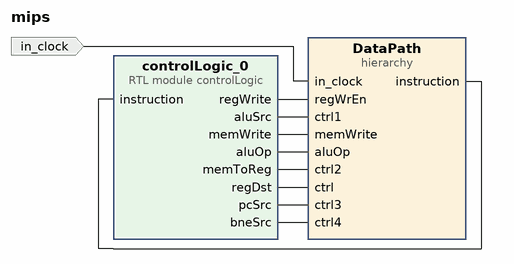
[diagram p0: block diagram of the top level]
# Vivado block design mips, xc7z020clg400-1, Vivado 2020.2
create_bd_design mips

create_bd_port -dir I -type clk in_clock

create_bd_cell -type hier DataPath
create_bd_cell -type module -reference controlLogic controlLogic_0

# ---- hierarchy /DataPath ----
current_bd_instance /DataPath
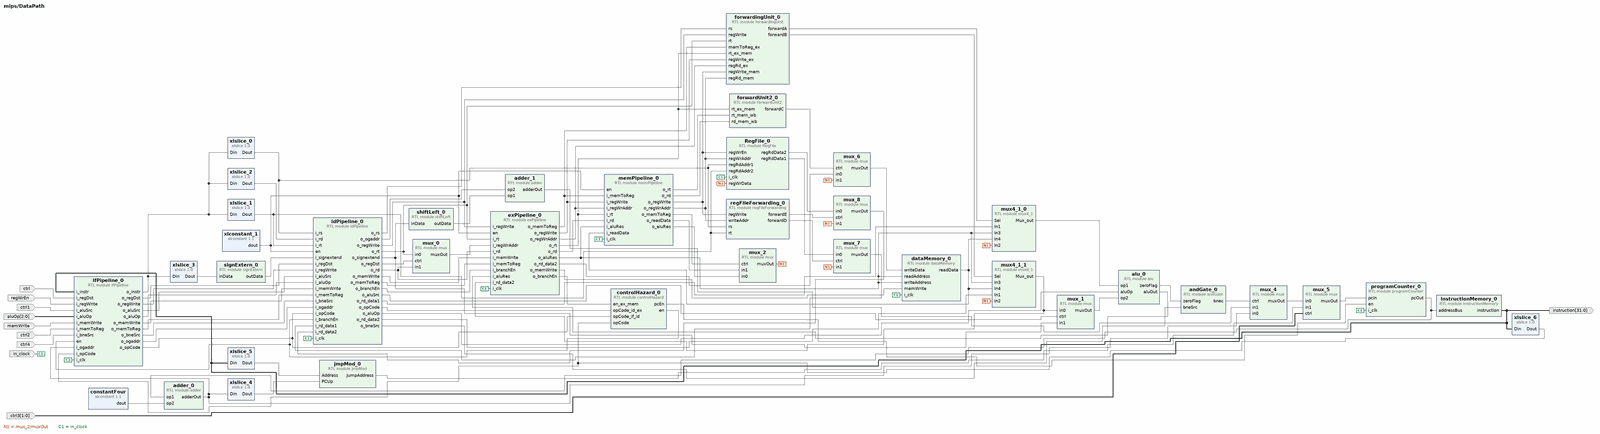
[diagram p1: block diagram inside /DataPath, whole]
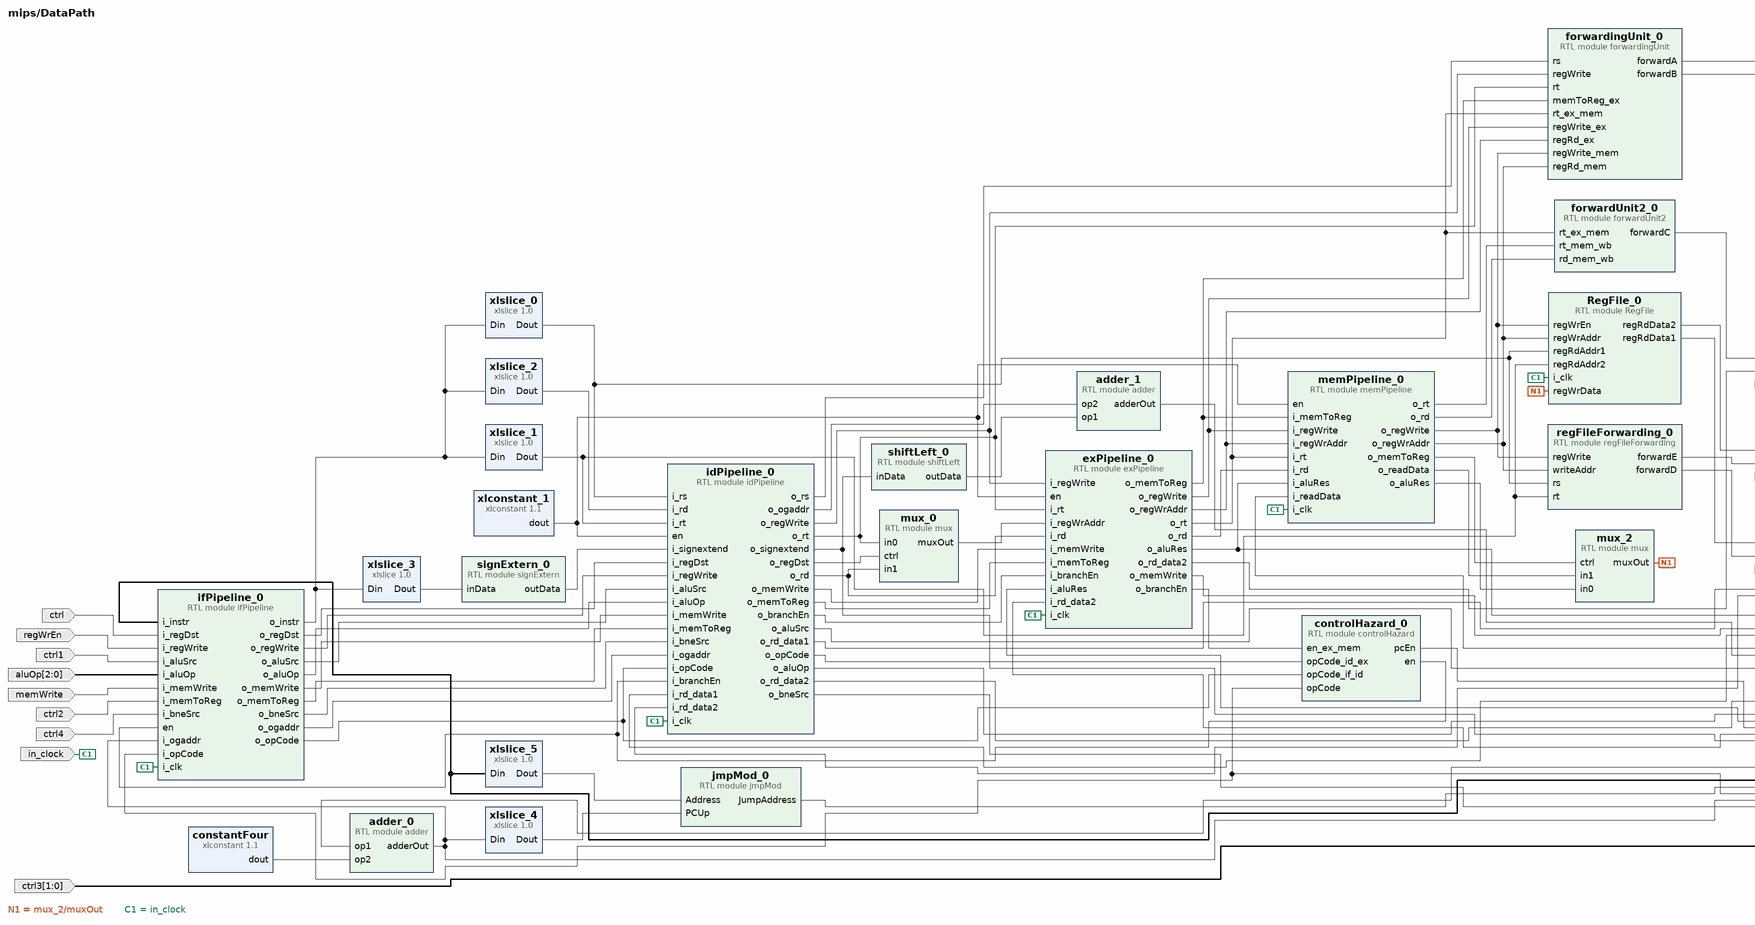
[diagram p2: block diagram inside /DataPath, left part]
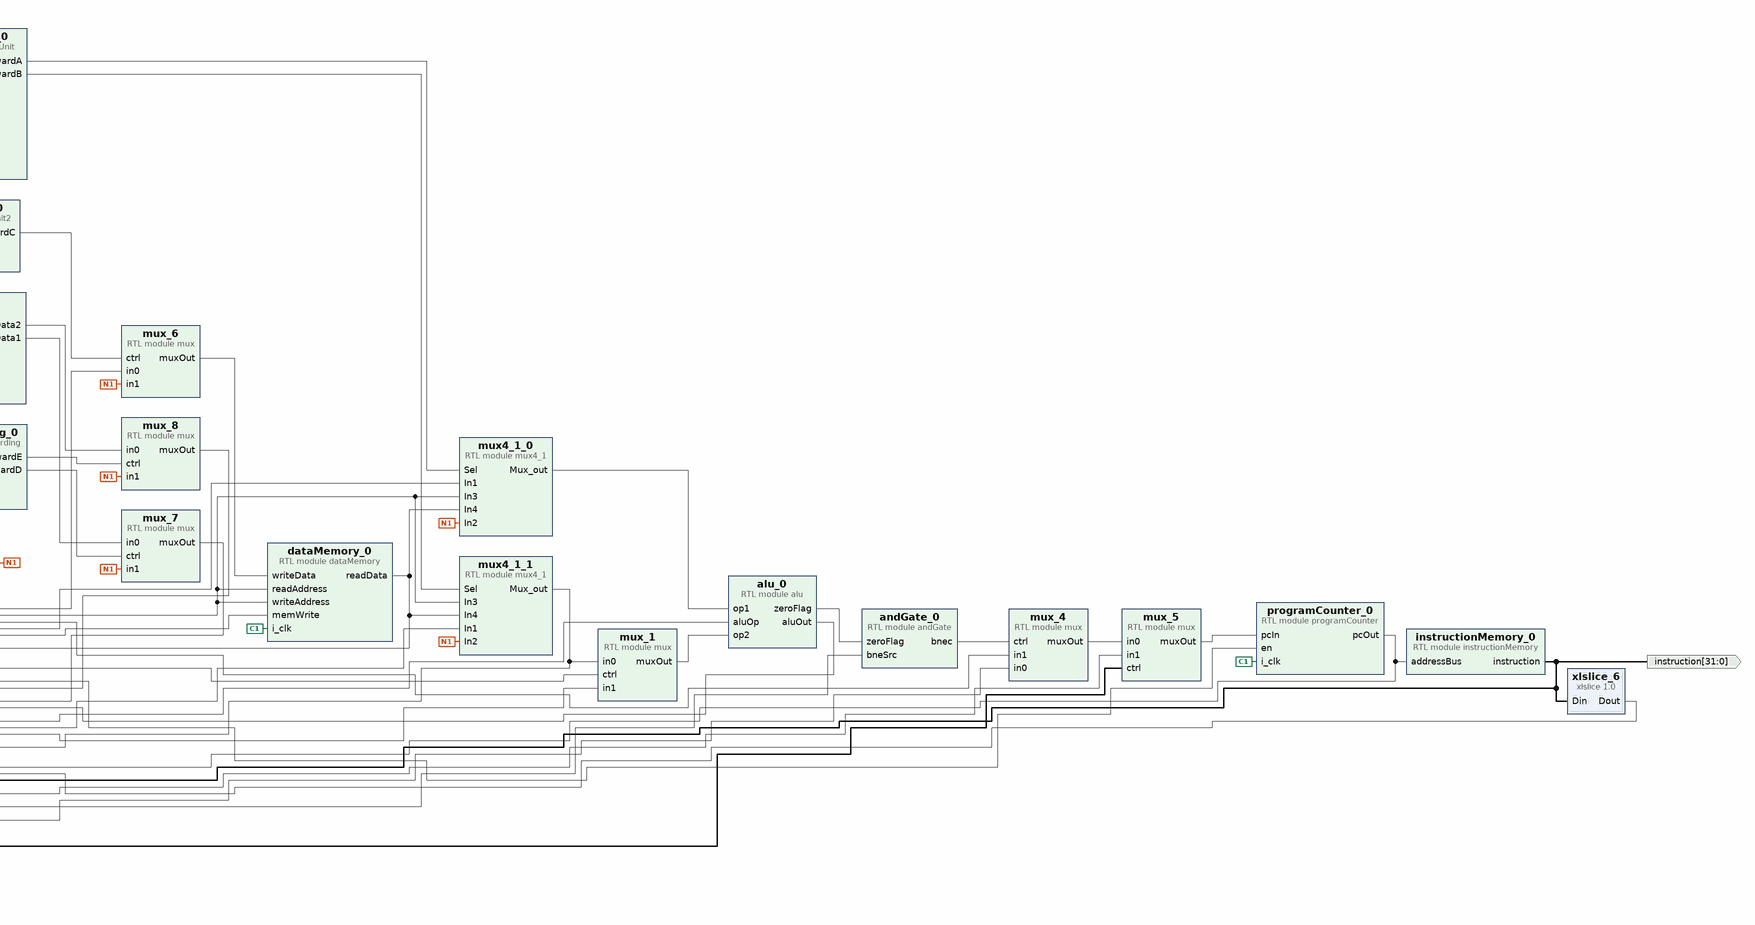
[diagram p3: block diagram inside /DataPath, right part]
create_bd_pin -dir I -from 2 -to 0 aluOp
create_bd_pin -dir I ctrl
create_bd_pin -dir O -from 31 -to 0 instruction
create_bd_pin -dir I ctrl1
create_bd_pin -dir I -type clk in_clock
create_bd_pin -dir I ctrl2
create_bd_pin -dir I -from 1 -to 0 ctrl3
create_bd_pin -dir I memWrite
create_bd_pin -dir I regWrEn
create_bd_pin -dir I ctrl4

create_bd_cell -type module -reference alu alu_0
create_bd_cell -type module -reference mux mux_0
set_property -dict {CONFIG.width 5} [get_bd_cells mux_0]
create_bd_cell -type ip -vlnv xilinx.com:ip:xlslice:1.0 xlslice_0
set_property -dict {CONFIG.DIN_FROM 25 CONFIG.DIN_TO 21 CONFIG.DOUT_WIDTH 5} [get_bd_cells xlslice_0]
create_bd_cell -type module -reference mux mux_1
set_property -dict {CONFIG.width 32} [get_bd_cells mux_1]
create_bd_cell -type module -reference mux mux_2
set_property -dict {CONFIG.width 32} [get_bd_cells mux_2]
create_bd_cell -type module -reference shiftLeft shiftLeft_0
create_bd_cell -type ip -vlnv xilinx.com:ip:xlslice:1.0 xlslice_1
set_property -dict {CONFIG.DIN_FROM 20 CONFIG.DIN_TO 16 CONFIG.DOUT_WIDTH 5} [get_bd_cells xlslice_1]
create_bd_cell -type ip -vlnv xilinx.com:ip:xlslice:1.0 xlslice_2
set_property -dict {CONFIG.DIN_FROM 15 CONFIG.DIN_TO 11 CONFIG.DOUT_WIDTH 5} [get_bd_cells xlslice_2]
create_bd_cell -type ip -vlnv xilinx.com:ip:xlconstant:1.1 constantFour
set_property -dict {CONFIG.CONST_VAL 4 CONFIG.CONST_WIDTH 32} [get_bd_cells constantFour]
create_bd_cell -type module -reference signExtern signExtern_0
create_bd_cell -type module -reference adder adder_0
set_property -dict {CONFIG.width 32} [get_bd_cells adder_0]
create_bd_cell -type module -reference adder adder_1
set_property -dict {CONFIG.width 32} [get_bd_cells adder_1]
create_bd_cell -type module -reference dataMemory dataMemory_0
create_bd_cell -type ip -vlnv xilinx.com:ip:xlslice:1.0 xlslice_3
set_property -dict {CONFIG.DIN_FROM 15 CONFIG.DOUT_WIDTH 16} [get_bd_cells xlslice_3]
create_bd_cell -type ip -vlnv xilinx.com:ip:xlslice:1.0 xlslice_4
set_property -dict {CONFIG.DIN_FROM 31 CONFIG.DIN_TO 28 CONFIG.DOUT_WIDTH 4} [get_bd_cells xlslice_4]
create_bd_cell -type ip -vlnv xilinx.com:ip:xlslice:1.0 xlslice_5
set_property -dict {CONFIG.DIN_FROM 25 CONFIG.DOUT_WIDTH 26} [get_bd_cells xlslice_5]
create_bd_cell -type module -reference jmpMod jmpMod_0
create_bd_cell -type ip -vlnv xilinx.com:ip:xlconstant:1.1 xlconstant_1
create_bd_cell -type module -reference mux mux_4
set_property -dict {CONFIG.width 32} [get_bd_cells mux_4]
create_bd_cell -type module -reference mux mux_5
set_property -dict {CONFIG.width 32} [get_bd_cells mux_5]
create_bd_cell -type module -reference RegFile RegFile_0
create_bd_cell -type module -reference mux4_1 mux4_1_0
create_bd_cell -type module -reference mux4_1 mux4_1_1
create_bd_cell -type module -reference mux mux_6
set_property -dict {CONFIG.width 32} [get_bd_cells mux_6]
create_bd_cell -type module -reference forwardUnit2 forwardUnit2_0
create_bd_cell -type module -reference forwardingUnit forwardingUnit_0
create_bd_cell -type module -reference regFileForwarding regFileForwarding_0
create_bd_cell -type module -reference mux mux_7
set_property -dict {CONFIG.width 32} [get_bd_cells mux_7]
create_bd_cell -type module -reference mux mux_8
set_property -dict {CONFIG.width 32} [get_bd_cells mux_8]
create_bd_cell -type module -reference exPipeline exPipeline_0
create_bd_cell -type ip -vlnv xilinx.com:ip:xlslice:1.0 xlslice_6
set_property -dict {CONFIG.DIN_FROM 31 CONFIG.DIN_TO 26 CONFIG.DOUT_WIDTH 6} [get_bd_cells xlslice_6]
create_bd_cell -type module -reference andGate andGate_0
create_bd_cell -type module -reference ifPipeline ifPipeline_0
create_bd_cell -type module -reference programCounter programCounter_0
create_bd_cell -type module -reference memPipeline memPipeline_0
create_bd_cell -type module -reference controlHazard controlHazard_0
create_bd_cell -type module -reference idPipeline idPipeline_0
create_bd_cell -type module -reference instructionMemory instructionMemory_0

# ---- connections ----

current_bd_instance /DataPath
connect_bd_net [get_bd_pins xlslice_0/Dout] [get_bd_pins RegFile_0/regRdAddr1] [get_bd_pins regFileForwarding_0/rs] [get_bd_pins idPipeline_0/i_rs]
connect_bd_net [get_bd_pins programCounter_0/pcOut] [get_bd_pins adder_0/op1] [get_bd_pins instructionMemory_0/addressBus]
connect_bd_net [get_bd_pins mux_2/muxOut] \
  [get_bd_pins RegFile_0/regWrData] [get_bd_pins mux4_1_0/In2] [get_bd_pins mux4_1_1/In2] [get_bd_pins mux_6/in1] \
  [get_bd_pins mux_7/in1] [get_bd_pins mux_8/in1]
connect_bd_net [get_bd_pins shiftLeft_0/outData] [get_bd_pins adder_1/op1]
connect_bd_net [get_bd_pins constantFour/dout] [get_bd_pins adder_0/op2]
connect_bd_net -net i_clk_0_1 [get_bd_pins in_clock] \
  [get_bd_pins dataMemory_0/i_clk] [get_bd_pins RegFile_0/i_clk] [get_bd_pins exPipeline_0/i_clk] \
  [get_bd_pins ifPipeline_0/i_clk] [get_bd_pins programCounter_0/i_clk] [get_bd_pins memPipeline_0/i_clk] \
  [get_bd_pins idPipeline_0/i_clk]
connect_bd_net [get_bd_pins xlslice_3/Dout] [get_bd_pins signExtern_0/inData]
connect_bd_net [get_bd_pins xlslice_4/Dout] [get_bd_pins jmpMod_0/PCUp]
connect_bd_net [get_bd_pins xlslice_5/Dout] [get_bd_pins jmpMod_0/Address]
connect_bd_net [get_bd_pins xlconstant_1/dout] [get_bd_pins exPipeline_0/en] [get_bd_pins memPipeline_0/en] [get_bd_pins idPipeline_0/en]
connect_bd_net [get_bd_pins instructionMemory_0/instruction] \
  [get_bd_pins xlslice_5/Din] [get_bd_pins instruction] [get_bd_pins xlslice_6/Din] [get_bd_pins ifPipeline_0/i_instr]
connect_bd_net [get_bd_pins idPipeline_0/o_ogaddr] [get_bd_pins adder_1/op2]
connect_bd_net [get_bd_pins adder_1/adderOut] [get_bd_pins mux_4/in1]
connect_bd_net [get_bd_pins jmpMod_0/JumpAddress] [get_bd_pins mux_5/in1]
connect_bd_net [get_bd_pins idPipeline_0/o_aluSrc] [get_bd_pins mux_1/ctrl]
connect_bd_net [get_bd_pins idPipeline_0/o_aluOp] [get_bd_pins alu_0/aluOp]
connect_bd_net [get_bd_pins idPipeline_0/o_memWrite] [get_bd_pins exPipeline_0/i_memWrite]
connect_bd_net [get_bd_pins exPipeline_0/o_memWrite] [get_bd_pins dataMemory_0/memWrite]
connect_bd_net [get_bd_pins idPipeline_0/o_memToReg] [get_bd_pins exPipeline_0/i_memToReg]
connect_bd_net [get_bd_pins exPipeline_0/o_memToReg] [get_bd_pins forwardingUnit_0/memToReg_ex] [get_bd_pins memPipeline_0/i_memToReg]
connect_bd_net [get_bd_pins memPipeline_0/o_memToReg] [get_bd_pins mux_2/ctrl]
connect_bd_net [get_bd_pins idPipeline_0/o_regDst] [get_bd_pins mux_0/ctrl]
connect_bd_net [get_bd_pins idPipeline_0/o_regWrite] [get_bd_pins forwardingUnit_0/regWrite] [get_bd_pins exPipeline_0/i_regWrite]
connect_bd_net [get_bd_pins exPipeline_0/o_regWrite] [get_bd_pins forwardingUnit_0/regWrite_ex] [get_bd_pins memPipeline_0/i_regWrite]
connect_bd_net [get_bd_pins memPipeline_0/o_regWrite] \
  [get_bd_pins RegFile_0/regWrEn] [get_bd_pins forwardingUnit_0/regWrite_mem] [get_bd_pins regFileForwarding_0/regWrite]
connect_bd_net [get_bd_pins RegFile_0/regRdData1] [get_bd_pins mux_7/in0]
connect_bd_net [get_bd_pins idPipeline_0/o_rd_data1] [get_bd_pins mux4_1_0/In1]
connect_bd_net [get_bd_pins RegFile_0/regRdData2] [get_bd_pins mux_8/in0]
connect_bd_net [get_bd_pins idPipeline_0/o_rd_data2] [get_bd_pins mux4_1_1/In1]
connect_bd_net [get_bd_pins alu_0/aluOut] [get_bd_pins exPipeline_0/i_aluRes]
connect_bd_net [get_bd_pins signExtern_0/outData] [get_bd_pins idPipeline_0/i_signextend]
connect_bd_net [get_bd_pins idPipeline_0/o_signextend] [get_bd_pins shiftLeft_0/inData] [get_bd_pins mux_1/in1]
connect_bd_net [get_bd_pins dataMemory_0/readData] [get_bd_pins mux4_1_1/In4] [get_bd_pins mux4_1_0/In4] [get_bd_pins memPipeline_0/i_readData]
connect_bd_net [get_bd_pins memPipeline_0/o_readData] [get_bd_pins mux_2/in1]
connect_bd_net [get_bd_pins exPipeline_0/o_aluRes] \
  [get_bd_pins dataMemory_0/writeAddress] [get_bd_pins dataMemory_0/readAddress] [get_bd_pins mux4_1_0/In3] \
  [get_bd_pins mux4_1_1/In3] [get_bd_pins memPipeline_0/i_aluRes]
connect_bd_net [get_bd_pins memPipeline_0/o_aluRes] [get_bd_pins mux_2/in0]
connect_bd_net [get_bd_pins ifPipeline_0/o_instr] \
  [get_bd_pins xlslice_0/Din] [get_bd_pins xlslice_1/Din] [get_bd_pins xlslice_2/Din] [get_bd_pins xlslice_3/Din]
connect_bd_net [get_bd_pins ctrl] [get_bd_pins ifPipeline_0/i_regDst]
connect_bd_net [get_bd_pins ifPipeline_0/o_regDst] [get_bd_pins idPipeline_0/i_regDst]
connect_bd_net [get_bd_pins regWrEn] [get_bd_pins ifPipeline_0/i_regWrite]
connect_bd_net [get_bd_pins ifPipeline_0/o_regWrite] [get_bd_pins idPipeline_0/i_regWrite]
connect_bd_net -net ctrl1_1 [get_bd_pins ctrl1] [get_bd_pins ifPipeline_0/i_aluSrc]
connect_bd_net [get_bd_pins ifPipeline_0/o_aluSrc] [get_bd_pins idPipeline_0/i_aluSrc]
connect_bd_net [get_bd_pins aluOp] [get_bd_pins ifPipeline_0/i_aluOp]
connect_bd_net [get_bd_pins ifPipeline_0/o_aluOp] [get_bd_pins idPipeline_0/i_aluOp]
connect_bd_net [get_bd_pins memWrite] [get_bd_pins ifPipeline_0/i_memWrite]
connect_bd_net [get_bd_pins ifPipeline_0/o_memWrite] [get_bd_pins idPipeline_0/i_memWrite]
connect_bd_net -net ctrl2_1 [get_bd_pins ctrl2] [get_bd_pins ifPipeline_0/i_memToReg]
connect_bd_net [get_bd_pins ifPipeline_0/o_memToReg] [get_bd_pins idPipeline_0/i_memToReg]
connect_bd_net [get_bd_pins andGate_0/bnec] [get_bd_pins mux_4/ctrl]
connect_bd_net -net ctrl4_1 [get_bd_pins ctrl4] [get_bd_pins ifPipeline_0/i_bneSrc]
connect_bd_net [get_bd_pins adder_0/adderOut] [get_bd_pins xlslice_4/Din] [get_bd_pins mux_4/in0] [get_bd_pins ifPipeline_0/i_ogaddr]
connect_bd_net [get_bd_pins mux_5/muxOut] [get_bd_pins programCounter_0/pcIn]
connect_bd_net [get_bd_pins xlslice_2/Dout] [get_bd_pins idPipeline_0/i_rd]
connect_bd_net [get_bd_pins xlslice_1/Dout] [get_bd_pins RegFile_0/regRdAddr2] [get_bd_pins regFileForwarding_0/rt] [get_bd_pins idPipeline_0/i_rt]
connect_bd_net -net idPipeline_0_o_wrRegAddr1 [get_bd_pins idPipeline_0/o_rt] \
  [get_bd_pins mux_0/in0] [get_bd_pins forwardingUnit_0/rt] [get_bd_pins exPipeline_0/i_rt]
connect_bd_net -net idPipeline_0_o_wrRegAddr2 [get_bd_pins idPipeline_0/o_rd] [get_bd_pins mux_0/in1] [get_bd_pins exPipeline_0/i_rd]
connect_bd_net [get_bd_pins alu_0/zeroFlag] [get_bd_pins andGate_0/zeroFlag]
connect_bd_net [get_bd_pins mux_0/muxOut] [get_bd_pins exPipeline_0/i_regWrAddr]
connect_bd_net [get_bd_pins exPipeline_0/o_regWrAddr] [get_bd_pins forwardingUnit_0/regRd_ex] [get_bd_pins memPipeline_0/i_regWrAddr]
connect_bd_net [get_bd_pins memPipeline_0/o_regWrAddr] \
  [get_bd_pins RegFile_0/regWrAddr] [get_bd_pins forwardingUnit_0/regRd_mem] [get_bd_pins regFileForwarding_0/writeAddr]
connect_bd_net [get_bd_pins forwardingUnit_0/forwardA] [get_bd_pins mux4_1_0/Sel]
connect_bd_net [get_bd_pins forwardingUnit_0/forwardB] [get_bd_pins mux4_1_1/Sel]
connect_bd_net [get_bd_pins idPipeline_0/o_rs] [get_bd_pins forwardingUnit_0/rs]
connect_bd_net [get_bd_pins mux4_1_0/Mux_out] [get_bd_pins alu_0/op1]
connect_bd_net [get_bd_pins exPipeline_0/o_rt] \
  [get_bd_pins forwardUnit2_0/rt_ex_mem] [get_bd_pins forwardingUnit_0/rt_ex_mem] [get_bd_pins memPipeline_0/i_rt]
connect_bd_net [get_bd_pins memPipeline_0/o_rt] [get_bd_pins forwardUnit2_0/rt_mem_wb]
connect_bd_net [get_bd_pins forwardUnit2_0/forwardC] [get_bd_pins mux_6/ctrl]
connect_bd_net [get_bd_pins exPipeline_0/o_rd_data2] [get_bd_pins mux_6/in0]
connect_bd_net [get_bd_pins mux_6/muxOut] [get_bd_pins dataMemory_0/writeData]
connect_bd_net [get_bd_pins exPipeline_0/o_rd] [get_bd_pins memPipeline_0/i_rd]
connect_bd_net [get_bd_pins memPipeline_0/o_rd] [get_bd_pins forwardUnit2_0/rd_mem_wb]
connect_bd_net [get_bd_pins mux4_1_1/Mux_out] [get_bd_pins mux_1/in0] [get_bd_pins exPipeline_0/i_rd_data2]
connect_bd_net [get_bd_pins mux_1/muxOut] [get_bd_pins alu_0/op2]
connect_bd_net [get_bd_pins regFileForwarding_0/forwardD] [get_bd_pins mux_7/ctrl]
connect_bd_net [get_bd_pins mux_7/muxOut] [get_bd_pins idPipeline_0/i_rd_data1]
connect_bd_net [get_bd_pins regFileForwarding_0/forwardE] [get_bd_pins mux_8/ctrl]
connect_bd_net [get_bd_pins mux_8/muxOut] [get_bd_pins idPipeline_0/i_rd_data2]
connect_bd_net [get_bd_pins controlHazard_0/en] [get_bd_pins ifPipeline_0/en] [get_bd_pins idPipeline_0/i_branchEn]
connect_bd_net [get_bd_pins idPipeline_0/o_branchEn] [get_bd_pins exPipeline_0/i_branchEn]
connect_bd_net [get_bd_pins xlslice_6/Dout] [get_bd_pins ifPipeline_0/i_opCode] [get_bd_pins controlHazard_0/opCode]
connect_bd_net [get_bd_pins ifPipeline_0/o_bneSrc] [get_bd_pins idPipeline_0/i_bneSrc]
connect_bd_net [get_bd_pins idPipeline_0/o_bneSrc] [get_bd_pins andGate_0/bneSrc]
connect_bd_net -net ctrl3_1 [get_bd_pins ctrl3] [get_bd_pins mux_5/ctrl]
connect_bd_net [get_bd_pins mux_4/muxOut] [get_bd_pins mux_5/in0]
connect_bd_net [get_bd_pins ifPipeline_0/o_ogaddr] [get_bd_pins idPipeline_0/i_ogaddr]
connect_bd_net [get_bd_pins exPipeline_0/o_branchEn] [get_bd_pins controlHazard_0/en_ex_mem]
connect_bd_net [get_bd_pins controlHazard_0/pcEn] [get_bd_pins programCounter_0/en]
connect_bd_net [get_bd_pins ifPipeline_0/o_opCode] [get_bd_pins controlHazard_0/opCode_if_id] [get_bd_pins idPipeline_0/i_opCode]
connect_bd_net [get_bd_pins idPipeline_0/o_opCode] [get_bd_pins controlHazard_0/opCode_id_ex]

current_bd_instance /
connect_bd_net -net i_clk_0_1 [get_bd_ports in_clock] [get_bd_pins DataPath/in_clock]
connect_bd_net -net instructionMemory_0_instruction [get_bd_pins DataPath/instruction] [get_bd_pins controlLogic_0/instruction]
connect_bd_net [get_bd_pins controlLogic_0/regWrite] [get_bd_pins DataPath/regWrEn]
connect_bd_net [get_bd_pins controlLogic_0/aluSrc] [get_bd_pins DataPath/ctrl1]
connect_bd_net [get_bd_pins controlLogic_0/memWrite] [get_bd_pins DataPath/memWrite]
connect_bd_net [get_bd_pins controlLogic_0/aluOp] [get_bd_pins DataPath/aluOp]
connect_bd_net [get_bd_pins controlLogic_0/memToReg] [get_bd_pins DataPath/ctrl2]
connect_bd_net [get_bd_pins controlLogic_0/regDst] [get_bd_pins DataPath/ctrl]
connect_bd_net [get_bd_pins controlLogic_0/pcSrc] [get_bd_pins DataPath/ctrl3]
connect_bd_net [get_bd_pins controlLogic_0/bneSrc] [get_bd_pins DataPath/ctrl4]

validate_bd_design
save_bd_design
